# Altium project IT_Asset_Tracking_Rack_Controller-H743.PrjPcb (part 2 of 3)

## Sheet NRF52840.SchDoc: NRF52840
size A3; Author: A.Horvath; Organization: Reichle & De-Massari; Address1: Binzstrasse 32; Address2: 8620 Wetzikon; Address3: Switzerland; DocumentNumber: 3; Revision: V0.1; SheetNumber: 3; SheetTotal: 11
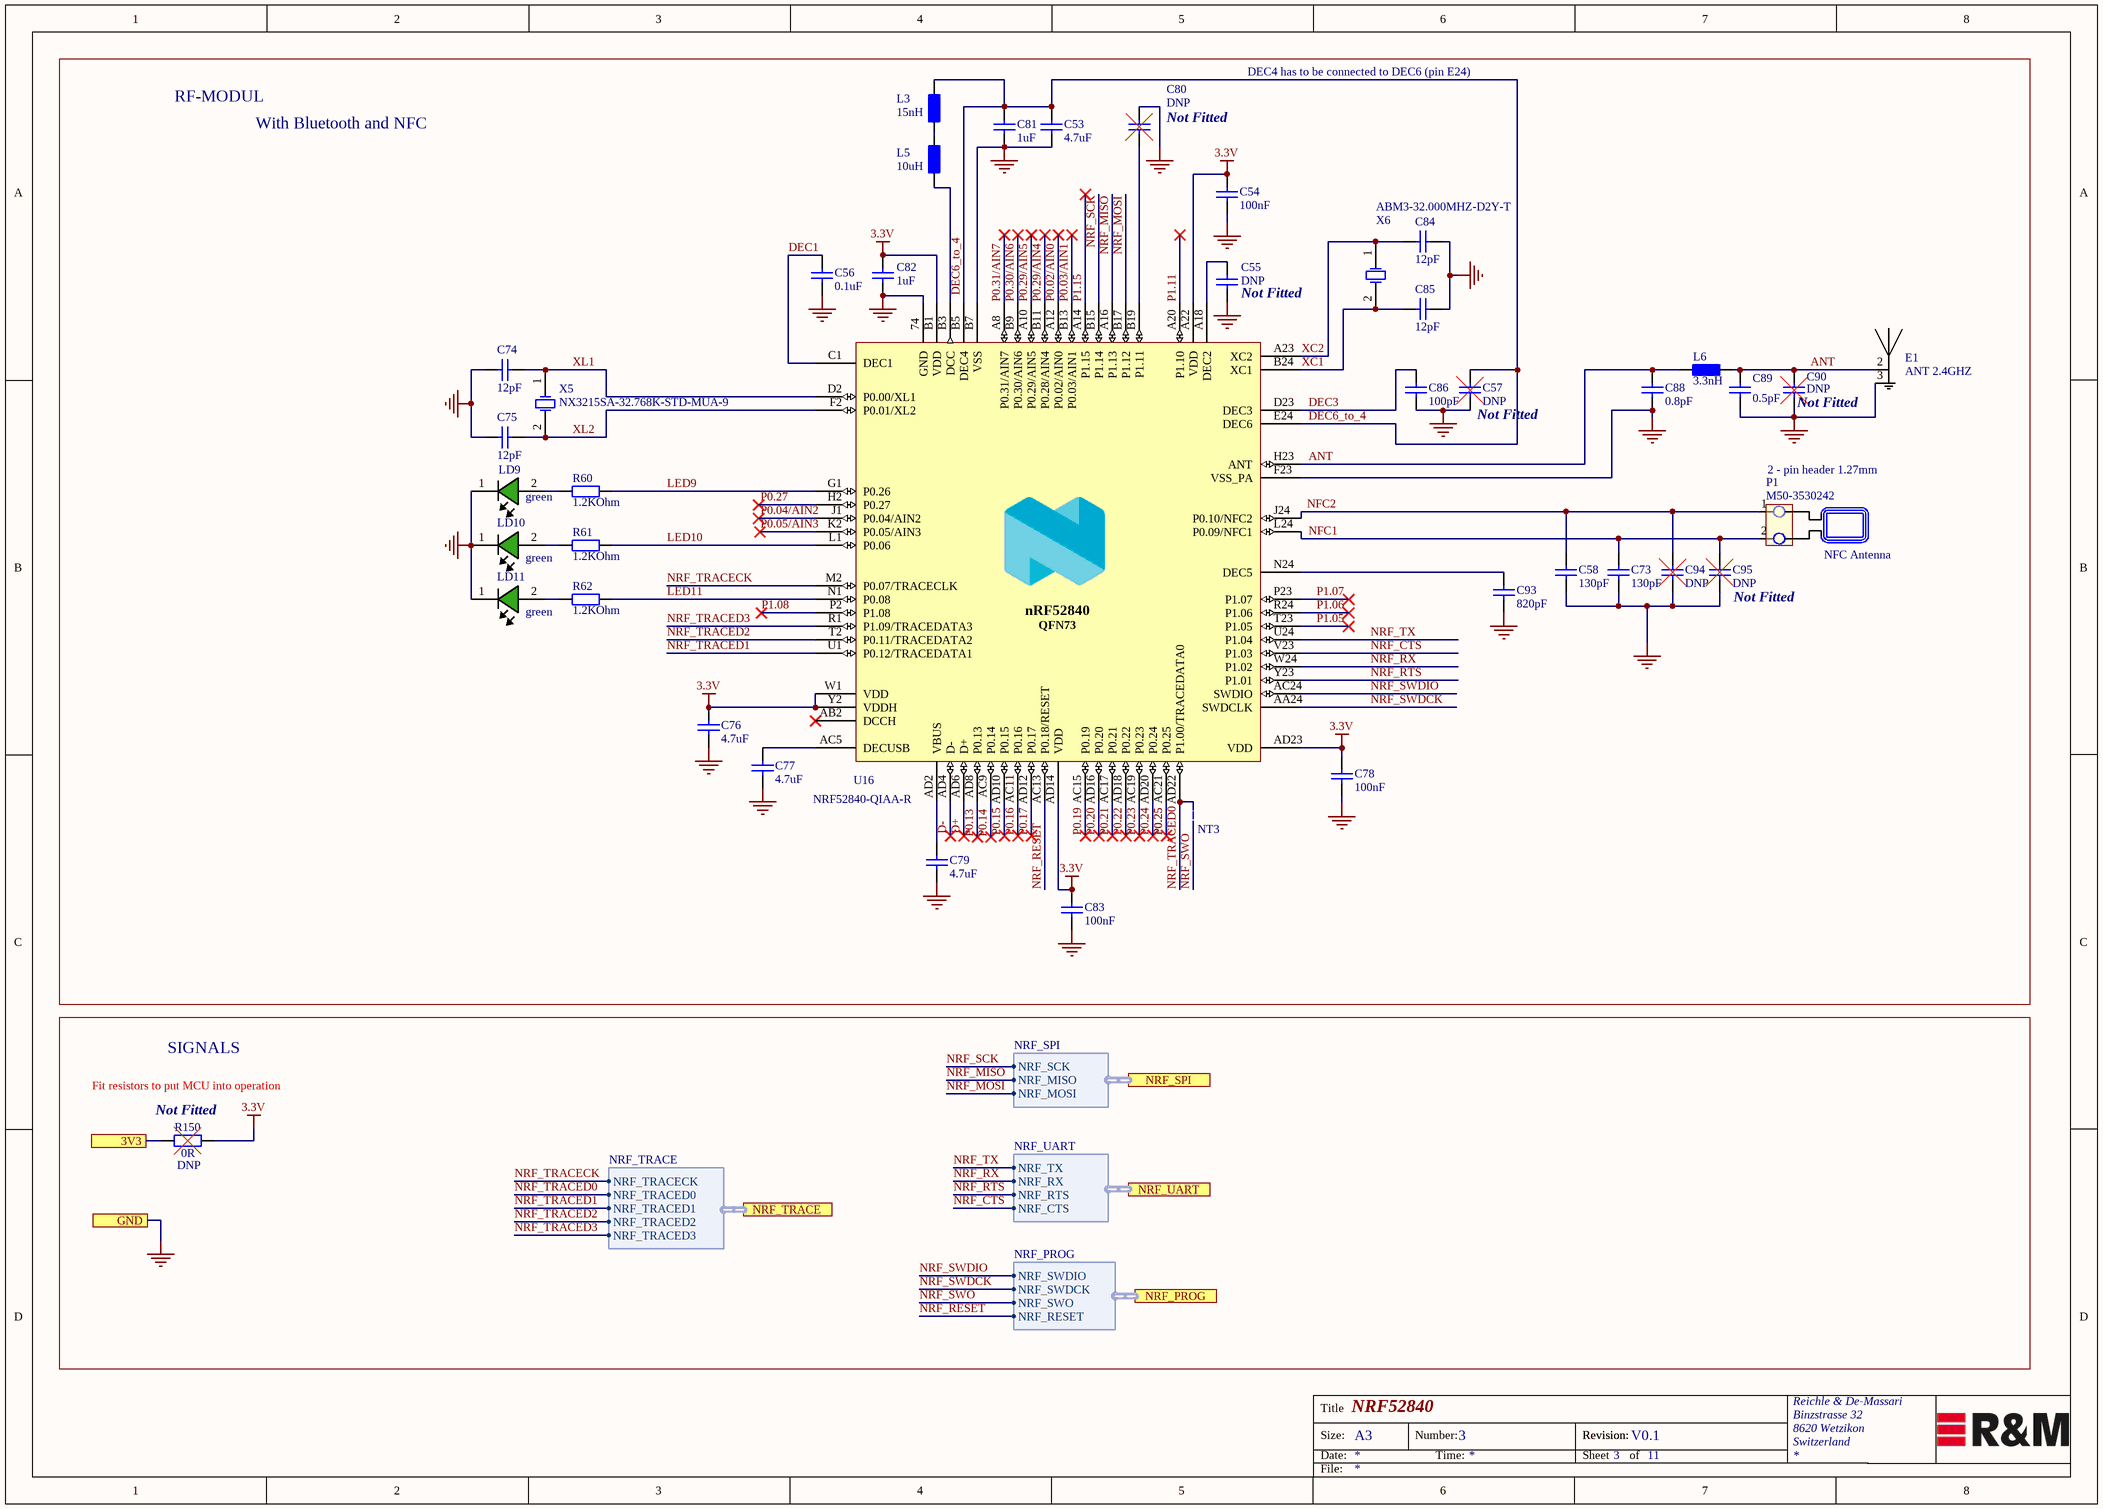
[diagram p7: NRF52840.SchDoc]

### Parts
C53  4.7uF  [Ceramic Capacitor 0402 EIA]
C54  100nF  [Ceramic Capacitor 0402 EIA]
C55  DNP  [Ceramic Capacitor 0402 EIA]
C56  0.1uF  [Ceramic Capacitor 0402 EIA]
C57  DNP  [Ceramic Capacitor 0402 EIA]
C58  130pF  [Ceramic Capacitor 0805 EIA]
C73  130pF  [Ceramic Capacitor 0805 EIA]
C74  12pF  [Ceramic Capacitor 0402 EIA]
C75  12pF  [Ceramic Capacitor 0402 EIA]
C76  4.7uF  [Ceramic Capacitor 0402 EIA]
C77  4.7uF  [Ceramic Capacitor 0402 EIA]
C78  100nF  [Ceramic Capacitor 0402 EIA]
C79  4.7uF  [Ceramic Capacitor 0402 EIA]
C80  DNP  [Ceramic Capacitor 0402 EIA]
C81  1uF  [Ceramic Capacitor 0402 EIA]
C82  1uF  [Ceramic Capacitor 0402 EIA]
C83  100nF  [Ceramic Capacitor 0402 EIA]
C84  12pF  [Ceramic Capacitor 0402 EIA]
C85  12pF  [Ceramic Capacitor 0402 EIA]
C86  100pF  [Ceramic Capacitor 0402 EIA]
C88  0.8pF  [Ceramic Capacitor 0402 EIA]
C89  0.5pF  [Ceramic Capacitor 0402 EIA]
C90  DNP  [Ceramic Capacitor 0805 EIA]
C93  820pF  [Ceramic Capacitor 0402 EIA]
C94  DNP  [Ceramic Capacitor 0805 EIA]
C95  DNP  [Ceramic Capacitor 0805 EIA]
E1  ANT 2.4GHZ  [XCVR_A5839]
L3  15nH  [INDC1005X55N]
L5  10uH  [INDC1608X100N]
L6  3.3nH  [LQG15HS3N3S02D]
LD9  green  [LED_APHHS1005CGCK]
LD10  green  [LED_APHHS1005CGCK]
LD11  green  [LED_APHHS1005CGCK]
NT3  Net-Tie_Small  [NET_TIE]  (value not drawn)  (net tie, no BOM)
P1  M50-3530242  [CONN_2x01_Harwin]  (net tie)
R60  1.2KOhm  [Resistor 0402 EIA]
R61  1.2KOhm  [Resistor 0402 EIA]
R62  1.2KOhm  [Resistor 0402 EIA]
R150  DNP  [Resistor 0805 EIA]
U16  NRF52840-QIAA-R  [AQFN50P700X700X85_HS-74N]
X5  NX3215SA-32.768K-STD-MUA-9  [NX3215SA]
X6  ABM3-32.000MHZ-D2Y-T  [XTAL500X320X130N]

### Blocks framed on the sheet
SIGNALS: R150

### Ports
3V3, GND, NRF_PROG (harness NRF_PROG), NRF_SPI (harness NRF_SPI), NRF_TRACE (harness NRF_TRACE), NRF_UART (harness NRF_UART)

### Harnesses
NRF_TRACE: NRF_TRACECK, NRF_TRACED0, NRF_TRACED1, NRF_TRACED2, NRF_TRACED3
NRF_UART: NRF_TX, NRF_RX, NRF_RTS, NRF_CTS
NRF_SPI: NRF_SCK, NRF_MISO, NRF_MOSI
NRF_PROG: NRF_SWDIO, NRF_SWDCK, NRF_SWO, NRF_RESET

### Nets
3.3V: C54.2 C76.2 C78.2 C82.2 C83.2 R150.2 U16.A22(VDD) U16.AD14(VDD) U16.AD23(VDD) U16.B1(VDD) U16.W1(VDD) U16.Y2(VDDH)
3V3: R150.1 ; port 3V3
GND: C53.1 C54.1 C55.1 C56.1 C57.1 C58.1 C73.1 C74.2 C75.2 C76.1 C77.1 C78.1 C79.1 C80.2 C81.1 C82.1 C83.1 C84.1 C85.1 C86.1 C88.2 C89.1 C90.1 C93.1 C94.1 C95.1 E1.3(GND) LD9.1 LD10.1 LD11.1 U16.74(GND) U16.B7(VSS) U16.F23(VSS_PA) ; port GND
ANT: C88.1 C89.2 C90.2 E1.2(FED) L6.1 L6.2 U16.H23(ANT)
D+: U16.AD6(D+)
D-: U16.AD4(D-)
DEC1: C56.2 U16.C1(DEC1)
DEC3: C86.2 U16.D23(DEC3)
DEC6_to_4: C53.2 C57.2 C81.2 L3.1 U16.B5(DEC4) U16.E24(DEC6)
LED9: R60.2 U16.G1(P0.26)
LED10: R61.2 U16.L1(P0.06)
LED11: R62.2 U16.N1(P0.08)
NFC1: C73.2 C95.2 P1.2 U16.L24(P0.09/NFC1)
NFC2: C58.2 C94.2 P1.1 U16.J24(P0.10/NFC2)
NRF_CTS: U16.V23(P1.03) ; port NRF_UART.NRF_CTS
NRF_MISO: U16.A16(P1.13) ; port NRF_SPI.NRF_MISO
NRF_MOSI: U16.B17(P1.12) ; port NRF_SPI.NRF_MOSI
NRF_RESET: U16.AC13(P0.18/RESET) ; port NRF_PROG.NRF_RESET
NRF_RTS: U16.Y23(P1.01) ; port NRF_UART.NRF_RTS
NRF_RX: U16.W24(P1.02) ; port NRF_UART.NRF_RX
NRF_SCK: U16.B15(P1.14) ; port NRF_SPI.NRF_SCK
NRF_SWDCK: U16.AA24(SWDCLK) ; port NRF_PROG.NRF_SWDCK
NRF_SWDIO: U16.AC24(SWDIO) ; port NRF_PROG.NRF_SWDIO
NRF_SWO: NT3.1 ; port NRF_PROG.NRF_SWO
NRF_TRACECK: U16.M2(P0.07/TRACECLK) ; port NRF_TRACE.NRF_TRACECK
NRF_TRACED0: NT3.2 U16.AD22(P1.00/TRACEDATA0) ; port NRF_TRACE.NRF_TRACED0
NRF_TRACED1: U16.U1(P0.12/TRACEDATA1) ; port NRF_TRACE.NRF_TRACED1
NRF_TRACED2: U16.T2(P0.11/TRACEDATA2) ; port NRF_TRACE.NRF_TRACED2
NRF_TRACED3: U16.R1(P1.09/TRACEDATA3) ; port NRF_TRACE.NRF_TRACED3
NRF_TX: U16.U24(P1.04) ; port NRF_UART.NRF_TX
P0.02/AIN0: U16.A12(P0.02/AIN0)
P0.03/AIN1: U16.B13(P0.03/AIN1)
P0.04/AIN2: U16.J1(P0.04/AIN2)
P0.05/AIN3: U16.K2(P0.05/AIN3)
P0.13: U16.AD8(P0.13)
P0.14: U16.AC9(P0.14)
P0.15: U16.AD10(P0.15)
P0.16: U16.AC11(P0.16)
P0.17: U16.AD12(P0.17)
P0.19: U16.AC15(P0.19)
P0.20: U16.AD16(P0.20)
P0.21: U16.AC17(P0.21)
P0.22: U16.AD18(P0.22)
P0.23: U16.AC19(P0.23)
P0.24: U16.AD20(P0.24)
P0.25: U16.AC21(P0.25)
P0.27: U16.H2(P0.27)
P0.29/AIN4: U16.B11(P0.28/AIN4)
P0.29/AIN5: U16.A10(P0.29/AIN5)
P0.30/AIN6: U16.B9(P0.30/AIN6)
P0.31/AIN7: U16.A8(P0.31/AIN7)
P1.05: U16.T23(P1.05)
P1.06: U16.R24(P1.06)
P1.07: U16.P23(P1.07)
P1.08: U16.P2(P1.08)
P1.11: U16.A20(P1.10)
P1.15: U16.A14(P1.15)
XC1: C85.2 U16.B24(XC1) X6.2(OSC2)
XC2: C84.2 U16.A23(XC2) X6.1(OSC1)
XL1: C74.1 U16.D2(P0.00/XL1) X5.1(OSC1)
XL2: C75.1 U16.F2(P0.01/XL2) X5.2(OSC2)
NetC55_2: C55.2 U16.A18(DEC2)
NetC77_2: C77.2 U16.AC5(DECUSB)
NetC79_2: C79.2 U16.AD2(VBUS)
NetC80_1: C80.1 U16.B19(P1.11)
NetC93_2: C93.2 U16.N24(DEC5)
NetL3_2: L3.2 L5.1
NetL5_2: L5.2 U16.B3(DCC)
NetLD9_2: LD9.2 R60.1
NetLD10_2: LD10.2 R61.1
NetLD11_2: LD11.2 R62.1

Not connected (* = marked no-connect by the designer): U16 AB2(DCCH)*

### Notes on the sheet
- RF-MODUL
- DEC4 has to be connected to DEC6 (pin E24)
- With Bluetooth and NFC
- (near C80) Not Fitted
- (near C55) Not Fitted
- (near C57) Not Fitted
- (near C90) Not Fitted
- (near P1) 2 - pin header 1.27mm
- (near P1) NFC Antenna
- (near C95) Not Fitted
- (near R150) Fit resistors to put MCU into operation
- (near R150) Not Fitted
- (near R150) 0R
- Title
- Size:
- Date:
- A3
- Number:
- Time:
- Revision:
- Sheet
- of
- File:
- (in symbol nRF52840_QIAA) nRF52840; QFN73

### Library data of the parts
C53 C76 C77 C79 = Cap_4.7uF_0603 _6.3V_X7R: 4.7µF ±10% 6.3V Ceramic Capacitor X7R 0603 (1608 Metric); Manufracturer: Taiyo Yuden; Manufacturer PartNr: JMK107BB7475KA-T; voltage: 6.3VDC; Replaceable: yes; tolerance: ±10%; ComponentLink1Description: mouser; ComponentLink1URL: https://www.mouser.ch/ProductDetail/Murata-Electronics/GRM155R60J475ME47D?qs=sGAEpiMZZMs0AnBnWHyRQIE6q%2f4qwWvwbJmEUwav8%2f4%3d; Dielectric Grade: X7R; Footprint/Package: 0603 (1608 metric); Supplier 1: Digi-Key; Supplier Part Number 1: 587-5870-1-ND; value: 4.7uF
C54 C78 C83 = Cap_100nF_0402_6V3: 0.1µF ±10% 6.3V Ceramic Capacitor X7R 0402 (1005 Metric); Manufacturer: Yageo; Manufacturer PartNr: CC0402KRX7R5BB104; Replaceable: yes; volatage: 6.3VDC; Dielectric Grade: X7R; Footprint/Package: 0402 (1005 metric); Supplier 1: Digi-Key; Supplier Part Number 1: 311-1701-1-ND; value: 100nF; tolerance: ±10%
C55 C57 = Cap_DNP_0402: Do not place 0402  (1005 metric) - placeholder; Replaceable: no; value: DNP; tolerance: *; voltage: *; Dielectric Grade: *; Manufacturer: N/A; Manufacturer PartNr: N/A; Footprint/Package: 0402 (1005 metric); Supplier 1: N/A; Supplier Part Number 1: N/A; Remark: do not place
C56 = Cap_0.1uF_0402_16V_10%: 0.1µF ±10% 16V Ceramic Capacitor X7R 0402 (1005 Metric); Manufacturer: Yageo; Manufacturer PartNr: CC0402KRX7R7BB104; voltage: 16VDC; Replaceable: yes; value: 0.1uF; tolerance: 10%; Footprint/Package: 0402 (1005 Metric); Dielectric Grade: X7R; ComponentLink1Description: mouser; ComponentLink1URL: https://www.mouser.ch/ProductDetail/KEMET/C0402C104M4RACAUTO?qs=sGAEpiMZZMs0AnBnWHyRQB295tntAovf0Dzw3tVX6zRfKTwHFThmZw%3d%3d; Supplier 1: Digi-Key; Supplier Part Number 1: 311-1338-1-ND
C58 C73 = Cap_130pF_0805 _50V: 130pF ±5% 50V Ceramic Capacitor C0G, NP0 0805 (2012 Metric); Manufacturer: KEMET; Manufacturer PartNr: C0805C131J5GAC7800; voltage: 50V DC; Dielectric Grade: C0G/NP0; Replaceable: yes; Supplier 1: Digi-Key; Supplier Part Number 1: 399-15446-1-ND; Footprint/Package: 0805 (2012 metric); value: 130pF; tolerance: ±5%; power: -
C74 C75 C84 C85 = Cap_12pF_0402_50V: 12pF ±2% 50V Ceramic Capacitor C0G, NP0 0402 (1005 Metric); Manufacturer: Murata; Manufacturer PartNr: GRM1555C1H120GA01D; voltage: 50VDC; Replaceable: yes; Dielectric Grade: C0G/NP0; value: 12pF; tolerance: ±2%; Footprint/Package: 0402 (1005 metric); Supplier 1: Digi-Key; Supplier Part Number 1: 490-6197-1-ND
C80 = Cap_1uF_0402_10V: 1µF ±10% 10V Ceramic Capacitor X7S 0402 (1005 Metric); Manufacturer: Murata; Manufacturer PartNr: GCM155C71A105KE38D; value: 1uF; voltage: 10VDC; Replaceable: yes; tolerance: 10%; Footprint/Package: 0402 (1005 metric); Dielectric Grade: X7S; ComponentLink1Description: mouser; ComponentLink1URL: https://www.mouser.ch/ProductDetail/Murata-Electronics/GCM155C71A105KE38D?qs=sGAEpiMZZMsh%252b1woXyUXj0FEAttKcN54ouz5zO04smg%3d; Supplier Part Number 1: 490-13409-1-ND; Supplier 1: Digi-Key
C81 C82 = Cap_1uF_0402_10V: 1µF ±10% 10V Ceramic Capacitor X7S 0402 (1005 Metric); Manufacturer: Murata; Manufacturer PartNr: GCM155C71A105KE38D; voltage: 10VDC; Replaceable: yes; value: 1uF; tolerance: 10%; Footprint/Package: 0402 (1005 metric); Dielectric Grade: X7S; ComponentLink1Description: mouser; ComponentLink1URL: https://www.mouser.ch/ProductDetail/Murata-Electronics/GCM155C71A105KE38D?qs=sGAEpiMZZMsh%252b1woXyUXj0FEAttKcN54ouz5zO04smg%3d; Supplier Part Number 1: 490-13409-1-ND; Supplier 1: Digi-Key
C86 = Cap_100pF_0402_10V: 100pF ±5% 10V Keramikkondensatoren C0G, NP0 0402 (1005 metrisch); Manufacturer: Yageo; Manufacturer PartNr: 885012005013; voltage: 10VDC; Replaceable: yes; Dielectric Grade: C0G/NP0; value: 100pF; tolerance: ±5%; Footprint/Package: 0402 (1005 metric); Supplier 1: Digi-Key; Supplier Part Number 1: 732-7431-1-ND
C88 = Cap_0.8pF_0402_50V: 0.8pF ±0.1pF 50V Ceramic Capacitor C0G, NP0 0402 (1005 Metric); Manufacturer: Murata; Manufacturer PartNr: GJM1555C1HR80BB01D; Dielectric Grade: C0G/NP0; Voltage: 50 VDC; Replaceable: yes; Supplier 1: Digi-Key; Supplier Part Number 1: 490-6080-1-ND; Footprint/Package: 0402 (1005 metric); value: 0.8pF; ComponentLink1URL: http://search.murata.co.jp/Ceramy/image/img/A01X/G101/ENG/GJM1555C1HR80BB01-01.pdf; ComponentLink1Description: http://search.murata.co.jp/Ceramy/image/img/A01X/G101/ENG/GJM1555C1HR80BB01-01.pdf; ComponentLink2URL: http://search.murata.co.jp/Ceramy/image/img/w_hinm/L0005E.pdf; ComponentLink2Description: http://search.murata.co.jp/Ceramy/image/img/w_hinm/L0005E.pdf; ComponentLink3URL: http://psearch.murata.com/capacitor/product/GJM1555C1HR80BB01%23.pdf; ComponentLink3Description: http://psearch.murata.com/capacitor/product/GJM1555C1HR80BB01%23.pdf; ComponentLink4URL: https://www.verical.com/server-webapp/html/getDatasheet?partID=75095; ComponentLink4Description: https://www.verical.com/server-webapp/html/getDatasheet?partID=75095; tolerance: ±0.1pF; power: -
C89 = Cap_0.5pF_0402_50V: 0.5pF ±0.05pF 50V Ceramic Capacitor C0G, NP0 0402 (1005 Metric), Murata; Manufacturer PartNr: GJM1555C1HR50WB01D; Dielectric Grade: C0G/NP0; Voltage: 50 VDC; Replaceable: yes; Supplier 1: Digi-Key; Supplier Part Number 1: 490-11250-1-ND; Manufacturer: Murata; Footprint/Package: 0402 (1005 metric); value: 0.5pF; tolerance: ±0.05pF; power: -; ComponentLink1Description: Datasheet; ComponentLink1URL: https://search.murata.co.jp/Ceramy/image/img/A01X/G101/ENG/GJM1555C1HR50WB01-01.pdf
C90 C94 C95 = Cap_DNP_0805: Do not place 0805 (2012 metric) - placeholder; Replaceable: no; value: DNP; tolerance: *; voltage: *; Dielectric Grade: *; Manufacturer: N/A; Manufacturer PartNr: N/A; Footprint/Package: 0805 (2012 metric); Supplier 1: N/A; Supplier Part Number 1: N/A; Remark: do not place
C93 = Cap_820pF_0402_50V: 820pF ±5% 50V Ceramic Capacitor C0G, NP0 0402 (1005 Metric); Manufacturer: Muarata Electronics; Manufacturer PartNr: GRM1555C1H821JA01J; voltage: 50 VDC; Replaceable: no; Dielectric Grade: C0G/NP0; value: 820pF; tolerance: ±5%; Footprint/Package: 0402 (1005 metric); ComponentLink1Description: digikey; ComponentLink1URL: https://www.digikey.com/product-detail/en/murata-electronics-north-america/GJM1555C1H150FB01D/490-11191-6-ND/5333833; Supplier 1: Digi-Key; Supplier Part Number 1: 490-11407-1-ND
E1 = Antenna_2.4GHZ_PCB: 2,4GHz Bluetooth, Wi-Fi, Zigbee PCB HF-Antenna,1dBi SMD, Antenova; Manufacturer Part Number: A5839; Replaceable: no; Package: None; Manufacturer: Antenova; value: ANT 2.4GHZ; Supplier 1: Digi-Key; Supplier Part Number 1: 627-1011-1-ND; Footprint/Package: specific see datasheet; tolerance: -; power: -; Dielectric Grade: -; voltage: -
L3 = Ind_15nH_0402: 15nH Unshielded Multilayer Inductor 320mA 460mOhm Max 0402 (1005 Metric),  Taiyo Yuden; Manufacturer PartNr: HK100515NJ-T; Replaceable: no; value: 15uH; tolerance: ±5%; Manufacturer: TAIYO YUDEN; voltage: *; power: -; Supplier Part Number 1: 587-1521-1-ND; Supplier 1: Digi-Key; Dielectric Grade: -; Footprint/Package: 0402 (1005 metric)
L5 = Ind_10uH_0603: 10µH Unshielded Wirewound Inductor 80mA 360mOhm 0603 (1608 Metric); Manufacturer: TAIYO YUDEN; Manufacturer PartNr: LBMF1608T100K; tolerance: ±10%; Replaceable: no; value: 10uH; Supplier 1: Digi-Key; Supplier Part Number 1: 587-1714-6-ND; voltage: *; power: *; Footprint/Package: 0603 (1608 metric)
L6 = Ind_3.3nH_0402: 3.3nH Unshielded Multilayer Inductor 800mA 170mOhm Max 0402 (1005 Metric); Manufacturer: Murata Electronics; Replaceable: no; Manufacturer PartNr: LQG15HS3N3S02D; Dielectric Grade: -; voltage: -; Supplier 1: DIgi-Key; Supplier Part Number 1: 490-2616-1-ND; Footprint/Package: 0402 (1005 metric); tolerance: -; value: 3.3nH
LD9-LD11 = LED_GREEN_0402: Green 570nm LED Indication - Discrete 2.1V 0402 (1005 Metric); Manufacturer: Kingbright; Manufacturer PartNr: APHHS1005CGCK; Replaceable: yes; voltage: 2.1V (forward); Footprint/Package: 0420 (1005 metric); value: green; Supplier 1: Digi-Key; Supplier Part Number 1: 754-1101-1-ND; Dielectric Grade: -; tolerance: -; power: -
NT3 = Net-Tie_Small: Net-Tie allowing to short two different types of nets.
P1 = CONN_1x2_M50-3530242: 2 Pin, 1 Row, Jumper, 1.27mm; Manufacturer: Harwin; Replaceable: yes; Footprint/Package: 1.27mm; ComponentLink1Description: digikey; ComponentLink1URL: https://www.digikey.com/product-detail/en/harwin-inc/M50-3530242/952-3598-ND/7044013; Supplier1: digikey; Supplier Part Number 1: 952-3598-ND; Dielectric Grade: -; power: -; voltage: -; value: M50-3530242; tolerance: -; Manufacturer PartNr: M50-3530242
R60-R62 = Res_1K2_0402: 1.2 kOhms ±0.5% 0.063W, 1/16W Chip Resistor 0402 (1005 Metric) Thin Film; Manufacturer: Panasonic; Manufacturer PartNr: ERA-2AED122X; value: 1.2K; voltage: 50V; Replaceable: yes; Supplier 1: Digi-Key; Supplier Part Number 1: P1.2KDECT-ND; Footprint/Package: 0402 (1005 metric); tolerance: ±0.5%; power: 0.063W, 1/16W; Dielectric Grade: -
R150 = Res_DNP_0805: Resistor: do not populate; Replaceable: no; value: DNP; tolerance: *; power: *; Manufacturer: do not populate; Footprint/Package: 0805; Manufacturer PartNr: do not populate
U16 = nRF52840_QIAA: Multi-protocol Bluetooth Low Energy, IEEE 802.15.4, ANT and 2.4GHz proprietary system-on-chip; Manufacturer: Nordic Semiconductor; Replaceable: no; voltage: 1.7V ~ 5.5V; Manufacturer PartNr: NRF52840-QIAA-R; power: -; Dielectric Grade: -; value: NRF52840-QIAA-R; Supplier 1: Digi-Key; Footprint/Package: 73-AQFN (7x7mm); Supplier  Part Number 1: 1490-1071-1-ND; tolerance: -
X5 = CRYSTAL_2Pin_ NX3215SA-32.768K-STD-MUA-9: 32.768kHz ±20ppm Crystal 9pF 70 kOhms 2-SMD, No Lead; Manufacturer: NDK America; Replaceable: no; Footprint/Package: 2-SMD, specific see datasheet; voltage: -; Manufacturer PartNr: NX3215SA-32.768K-STD-MUA-9; value: NX3215SA-32.768K-STD-MUA-9; Supplier 1: Digi-Key; Supplier Part Number 1: 644-1155-1-ND; tolerance: ±20ppm; Dielectric Grade: -; power: -
X6 = CRYSTAL_2Pin_32.000MHZ-D2Y-T: Crystal  32MHz ±20ppm Crystal 18pF 25 Ohms 2-SMD, No Lead; Manufacturer: Abracon; Replaceable: no; Footprint/Package: 2-SMD, specific see datasheet; voltage: -; Manufacturer PartNr: ABM3-32.000MHZ-D2Y-T; Price: None; value: ABM3-32.000MHZ-D2Y-T; Supplier 1: Digi-Key; Supplier Part Number 1: 535-10648-6-ND; tolerance: ±20ppm; Dielectric Grade: -

## Sheet RS-485.SchDoc: RS-485
size A3; Author: A.Horvath; Organization: Reichle & De-Massari; Address1: Binzstrasse 32; Address2: 8620 Wetzikon; Address3: Switzerland; DocumentNumber: 5; Revision: 0.1V; SheetNumber: 5; SheetTotal: 11
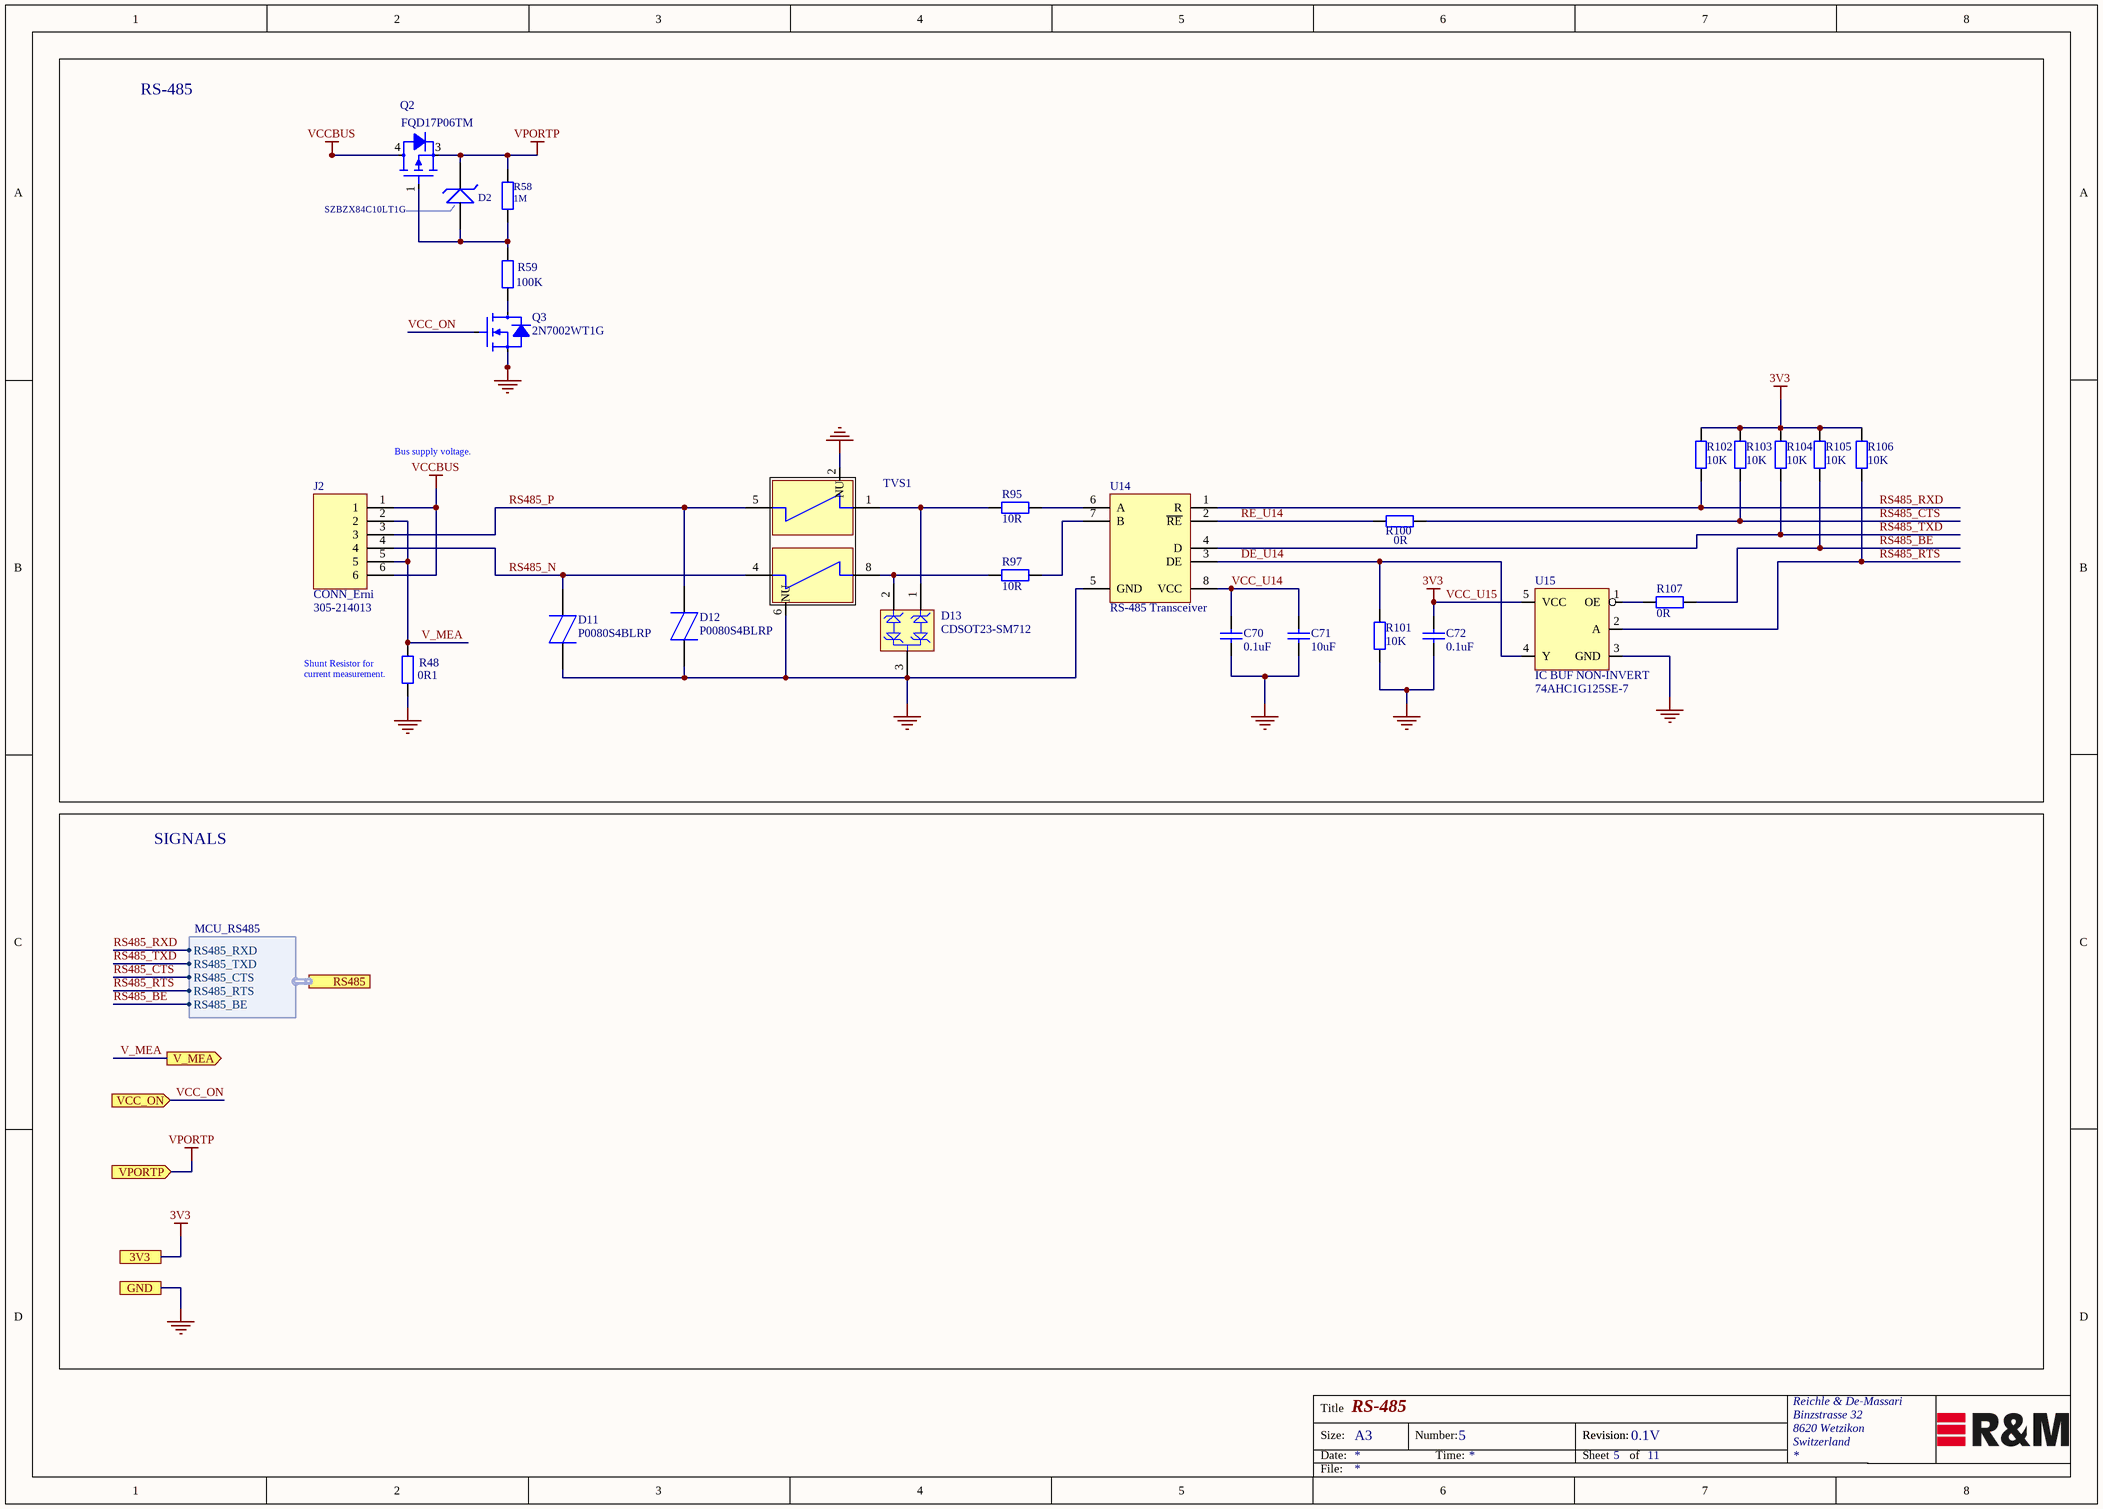
[diagram p8: RS-485.SchDoc]

### Parts
C70  0.1uF  [Ceramic Capacitor 0402 EIA]
C71  10uF  [Ceramic Capacitor 0402 EIA]
C72  0.1uF  [Ceramic Capacitor 0402 EIA]
D2  SZBZX84C10LT1G  [SOT-23_BZX84]
D11  P0080S4BLRP  [P0080S4BLRP]
D12  P0080S4BLRP  [P0080S4BLRP]
D13  CDSOT23-SM712  [BOUR-SOT23-3_V]
J2  CONN_Erni  Supplier Part Number 1: 305-214013  [ERNI_214013 Randmontage_6_R]
Q2  FQD17P06TM  [DPAK_FQU17P06]
Q3  2N7002WT1G  [SOT323_2N7002WT1G]
R48  0R1  [Resistor 4527]
R58  1M  [Resistor 0402 EIA]
R59  100K  [Resistor 0402 EIA]
R95  10R  [Resistor 0603 EIA]
R97  10R  [Resistor 0603 EIA]
R100  0R  [Resistor 0402 EIA]
R101  10K  [Resistor 0402 EIA]
R102  10K  [Resistor 0402 EIA]
R103  10K  [Resistor 0402 EIA]
R104  10K  [Resistor 0402 EIA]
R105  10K  [Resistor 0402 EIA]
R106  10K  [Resistor 0402 EIA]
R107  0R  [Resistor 0402 EIA]
TVS1  TBU-CA065-200-WH  [Bourns_TBU_PL060_WH]  (value not drawn)
U14  RS-485 Transceiver  [TI_D (R-PDSO-G8)_8_R]
U15  IC BUF NON-INVERT  [SOT353]

### Blocks framed on the sheet
RS-485: C70-C72 D2 D11-D13 J2 Q2 Q3 R48 R58 R59 R95 R97 R100-R107 TVS1 U14 U15

### Ports
3V3, GND, RS485 (harness MCU_RS485), V_MEA (out), VCC_ON (in), VPORTP (in)

### Harnesses
MCU_RS485: RS485_RXD, RS485_CTS, RS485_TXD, RS485_BE, RS485_RTS

### Nets
3V3: C72.2 R102.1 R103.1 R104.1 R105.1 R106.1 U15.5(VCC) ; port 3V3  [also labelled VCC_U15]
GND: C70.1 C71.1 C72.1 D11.1(A) D12.1(A) D13.3 Q3.2 R48.2 R101.2 TVS1.2(NU) TVS1.6(NU) U14.5(GND) U15.3(GND) ; port GND
VCCBUS: J2.1 J2.6 Q2.4
VPORTP: D2.3(K) Q2.3 R58.1 ; port VPORTP
DE_U14: R101.1 U14.3(DE) U15.4(Y)
RE_U14: R100.1 U14.2(~{RE})
RS485_BE: R105.2 R107.2 ; port RS485.RS485_BE
RS485_CTS: R100.2 R103.2 ; port RS485.RS485_CTS
RS485_N: D11.2(K) J2.4 TVS1.4
RS485_P: D12.2(K) J2.3 TVS1.5
RS485_RTS: R106.2 U15.2(A) ; port RS485.RS485_RTS
RS485_RXD: R102.2 U14.1(R) ; port RS485.RS485_RXD
RS485_TXD: R104.2 U14.4(D) ; port RS485.RS485_TXD
V_MEA: J2.2 J2.5 R48.1 ; port V_MEA
VCC_ON: Q3.1 ; port VCC_ON
VCC_U14: C70.2 C71.2 U14.8(VCC)
NetD2_1: D2.1(A) Q2.1 R58.2 R59.1
NetD13_1: D13.1 R95.1 TVS1.1
NetD13_2: D13.2 R97.1 TVS1.8
NetQ3_3: Q3.3 R59.2
NetR95_2: R95.2 U14.6(A)
NetR97_2: R97.2 U14.7(B)
NetR107_1: R107.1 U15.1(OE)

### Notes on the sheet
- Bus supply voltage.
- (near R48) Shunt Resistor for current measurement.
- SIGNALS
- Title
- Size:
- Date:
- A3
- Number:
- Time:
- Revision:
- Sheet
- of
- File:

### Library data of the parts
C70 C72 = Cap_0.1uF_0402_10V: as C98 on sheet MCU_STM32H743BI; value: 0.1uF; tolerance: 20%; Footprint/Package: 0402; Dielectric Grade: X5R; ComponentLink1Description: mouser; ComponentLink1URL: https://www.mouser.ch/ProductDetail/Wurth-Electronics/885012105010?qs=sGAEpiMZZMs0AnBnWHyRQEGbLOF2VP1ihL84oCjXnlO407YOHi%2fQbw%3d%3d; Supplier 1: Digi-Key; Supplier 2: Farnell; Supplier 3: Mouser; Supplier Part Number 3: 710-885012105010; Supplier Part Number 2: 2533928; Supplier Part Number 1: 732-7487-1-ND
C71 = Cap_10uF_0402_10V: 10µF ±20% 10V Ceramic Capacitor X5R 0402 (1005 Metric); Manufacturer: Samsung Electro-Mechanics; Manufacturer PartNr: CL05A106MP8NUB8; voltage: 10VDC; Replaceable: yes; value: 10uF; tolerance: 20%; ComponentLink1Description: mouser; ComponentLink1URL: https://www.mouser.ch/ProductDetail/Murata-Electronics/ZRB15XR61A106ME01D?qs=sGAEpiMZZMs0AnBnWHyRQN7%2fAA2D2lPPC0%2fdyv23S%2fU%252bBeuYI5b1UA%3d%3d; Footprint/Package: 0402 (1005 metric); Dielectric Grade: X5R; Supplier 1: Digi-Key; Supplier Part Number 1: 1276-6830-1-ND
D2 = Diode_SZBZX84C10LT1G: Zener Diode 10V 225mW ±6% Oberflächenmontage SOT-23-3 (TO-236); Manufacturer: ON Semiconductor; Replaceable: no; Manufacturer PartNr: SZBZX84C10LT1G; Footprint/Package: SOT-23-3 (TO-236); Supplier 1: Digi-Key; Supplier Part Number 1: SZBZX84C10LT1GOSDKR-ND; power: 225mW; value: SZBZX84C10LT1G; voltage: 10V
D11 D12 = P0080S4BLRP: Thyristor Surge Protection Devices (TSPD) PxxxxS4xLRP Series SIDACtor Protection Thyristor 100A 25V Bi SOD; Manufacturer: Littelfuse; Replaceable: no; ComponentLink1Description: mouser; ComponentLink1URL: https://www.mouser.ch/ProductDetail/Diodes-Incorporated/DESD3V3S1BL-7B?qs=%2fha2pyFaduhA707awRoRgtNXj1BWecNQPXz8CtVYm9O48rqwfwJI0g%3d%3d; Footprint/Package: SOD-123FL; Supplier 1: Mouser; Supplier Part Number 1: 576-P0080S4BLRP; Supplier 2: Digikey; Supplier Part Number 2: P0080S4BLRPCT-ND; Manufacturer PartNr: P0080S4BLRP
D13 = Diode_TVS_26V: TVSDiode, 26V, 14V Clamp 17A (8/20µs) Ipp, Surface Mount SOT-23-3, Applications RS-485; Manufacturer: Bourns; power: 400W; Replaceable: no; Dielectric Grade: NA; Supplier 1: Digi-Key; Package / Case: TO-236-3,SC-59,SOT-23-3; Supplier Part Number 1: CDSOT23-SM712CT-ND; voltage: 26V, 14V; value: CDSOT23-SM712; Footprint/Package: DO-214AC-2 (SMA); Manufacturer PartNr: CDSOT23-SM712
J2 = CONN_Erni_6_214013: Headers & Wire Housings 6P 1.27MM SNGL ROW R/A MALE BLK; Manufacturer: ERNI; Manufacturer PartNr: 214013; Replaceable: no; Footprint/Package: 1.27mm; ComponentLink1Description: mouser; ComponentLink1URL: https://www.mouser.ch/ProductDetail/ERNI/214013?qs=sGAEpiMZZMvMXbh32ZmHAMhEPQG9jaj7Ou3J%2fuOb4IQ%3d; Supplier 1: Mouser
Q2 = FQD17P06TM: P-Channel 60V 12A (Tc) 2.5W (Ta), 44W (Tc) Surface Mount D-Pak; Manufacturer: ON Semiconductor; tolerance: NA; Replaceable: no; value: FQD17P06TM; voltage: 60V; Manufacturer PartNr: FQD17P06TM; Footprint/Package: TO-252-3, DPak; Dielectric Grade: NA; ComponentLink1Description: mouser; ComponentLink1URL: https://www.mouser.ch/ProductDetail/Murata-Electronics/GCM155C71A105KE38D?qs=sGAEpiMZZMsh%252b1woXyUXj0FEAttKcN54ouz5zO04smg%3d; Supplier Part Number 1: FQD17P06TMCT-ND; Supplier 1: Digi-Key; power: 2.5W
Q3 = 2N7002WT1G: N-Channel 60V 310mA (Ta) 280mW (Tj) Surface Mount SC-70-3 (SOT323); Manufacturer: ON Semiconductor; tolerance: NA; Replaceable: no; value: 2N7002WT1G; voltage: 60V; Manufacturer PartNr: 2N7002WT1G; Footprint/Package: SC-70, SOT-323; Dielectric Grade: NA; ComponentLink1Description: mouser; ComponentLink1URL: https://www.mouser.ch/ProductDetail/Murata-Electronics/GCM155C71A105KE38D?qs=sGAEpiMZZMsh%252b1woXyUXj0FEAttKcN54ouz5zO04smg%3d; Supplier Part Number 1: 2N7002WT1GOSCT-ND; Supplier 1: Digi-Key; power: 280mW
R48 = Res_0R1: 100 mOhms ±1% 5W Chip Resistor 4527 J-Lead Anti-Sulfur, Automotive AEC-Q200, Current Sense, Moisture Resistant; Manufacturer: Vishay / Dale; Manufacturer PartNr: WSR5R1000FEA; Replaceable: no; value: 0R1; tolerance: ±1%; power: 5W; Footprint/Package: 4527 (11570 metric); Supplier 1: Digi-Key; Supplier Part Number 1: WSRC-.1CT-ND
R58 = Res_1M_0402: 1 MOhms ±1% 0.1W, 1/10W Chip Resistor 0402 (1005 Metric) Anti-Sulfur Thin Film; Manufacturer: Vishay Beyschlag; Manufacturer PartNr: MCS04020C1004FE000; Replaceable: yes; Supplier 1: Digi-Key; Supplier Part Number 1: MCS0402-1.00M-CFCT-ND; Footprint/Package: 0402 (1005 metric); value: 1M; power: 0.1W, 1/10W; tolerance: ±1%; Dielectric Grade: -
R59 = Res_100K_0402: 100 kOhms ±0,1% 0,063W, 1/16W Chip-Widerstand 0402 (1005 metrisch) Dünnschicht; Manufacturer: Yageo; Manufacturer PartNr: RT0402BRD07100KL; tolerance: ±0.1%; Replaceable: yes; value: 100K; power: 0,063W, 1/16W; Footprint/Package: 0402 (1005 metrisch); Supplier 1: Digi-Key; Supplier Part Number 1: YAG1343CT-ND
R95 R97 = Res_10R_0603: SMD 1/4watt 10ohms 1%; Manufacturer: Vishay; Manufacturer PartNr: CRCW060310R0FKEAHP; power: 250mW; Replaceable: yes; value: 10R; tolerance: 1%; Footprint/Package: 0603 (1608 metric); Supplier 1: Digi-Key; Supplier 2: Mouser; Supplier Part Number 2: CRCW060310R0FKEAHP; Supplier Part Number 1: 541-10.0SCT-ND
R100 R107 = Res_0R_0402: 0 Ohms Resistor 0402; Manufacturer: Panasonic Electronic Components; Manufacturer PartNr: ERJ-2GE0R00X; power: 100mW; Replaceable: yes; value: 0R; tolerance: -; Footprint/Package: 0402 (1005 metric); Supplier 1: Digi-Key; Supplier Part Number 1: P0.0JCT-ND
R101-R106 = Res_10K_0402: SMD 10K ohm 1% 50V General Purpose; Manufacturer: Yageo; Manufacturer PartNr: RC0402FR-1010KL; power: 63mW; Replaceable: yes; value: 10K; tolerance: 1%; ComponentLink1Description: mouser; ComponentLink1URL: https://www.mouser.ch/ProductDetail/Yageo/RC0402FR-1010KL?qs=sGAEpiMZZMtlubZbdhIBIEgN9MQql2m6Sb2LnYlCICU%3d; Footprint/Package: 0402; Supplier 1: Mouser; Supplier Part Number 1: 603-RC0402FR-1010KL; Supplier 2: Digi-Key; Supplier Part Number 2: *
TVS1 = Bourns_TBU-PL060-200-WH: TBU-PL Series dual 50 ohm Surge Suppressors, bi-directional; Manufacturer: Bourns; Replaceable: no; voltage: 350V; power: NA; Manufacturer PartNr: TBU-PL060-200-WH; Supplier 1: Mouser; Footprint/Package: DFN; Supplier Part Number 1: 652-TBU-PL060-200-WH; value: TBU-PL060-200-WH; Dielectric Grade: NA
U14 = SN65HVD11DR: RS-485 Interface IC 3.3V Differential Transceivers; Manufacturer: Texas Instruments; Replaceable: no; Manufacturer PartNr: SN65HVD11DR; ComponentLink1Description: mouser; ComponentLink1URL: https://www.mouser.ch/ProductDetail/Texas-Instruments/SN65HVD11DR?qs=sGAEpiMZZMtk5jbcouIbS2cUqarwnJ3LOIItPoxnG4E%3d; Footprint/Package: SOIC-8; Supplier 1: Digi-Key; Supplier 2: Farnell; Supplier 3: Mouser; Supplier Part Number 1: 296-31717-6-ND; Supplier Part Number 2: 2436743; Supplier Part Number 3: 595-SN65HVD11DR
U15 = 74AHC1G125SE-7: Buffer, Non-Inverting 1 Element 1 Bit per Element 3-State Output SOT-353; Manufacturer: Diodes Incorporated; Replaceable: no; Footprint/Package: SOT353; ComponentLink1Description: mouser; ComponentLink1URL: https://www.mouser.ch/ProductDetail/Samtec/BBL-103-G-E?qs=sGAEpiMZZMs%252bGHln7q6pm5ZHNJhTjtr3eyJKd0ZImQM%3d; Supplier 2: Mouser; Supplier 1: Digi-Key; Supplier 3: Farnell; Supplier Part Number 1: SAM1104-03-ND; Supplier Part Number 2: 200-SL103G12; Supplier Part Number 3: 2019491; Manufacturer PartNr: 74AHC1G125SE-7

## Sheet Connectors.SchDoc: Connectors
size A3; Author: A.Horvath; Organization: Reichle & De-Massari; Address1: Binzstrasse 32; Address2: 8620 Wetzikon; Address3: Switzerland; DocumentNumber: 9; Revision: V0.1; SheetNumber: 9; SheetTotal: 11
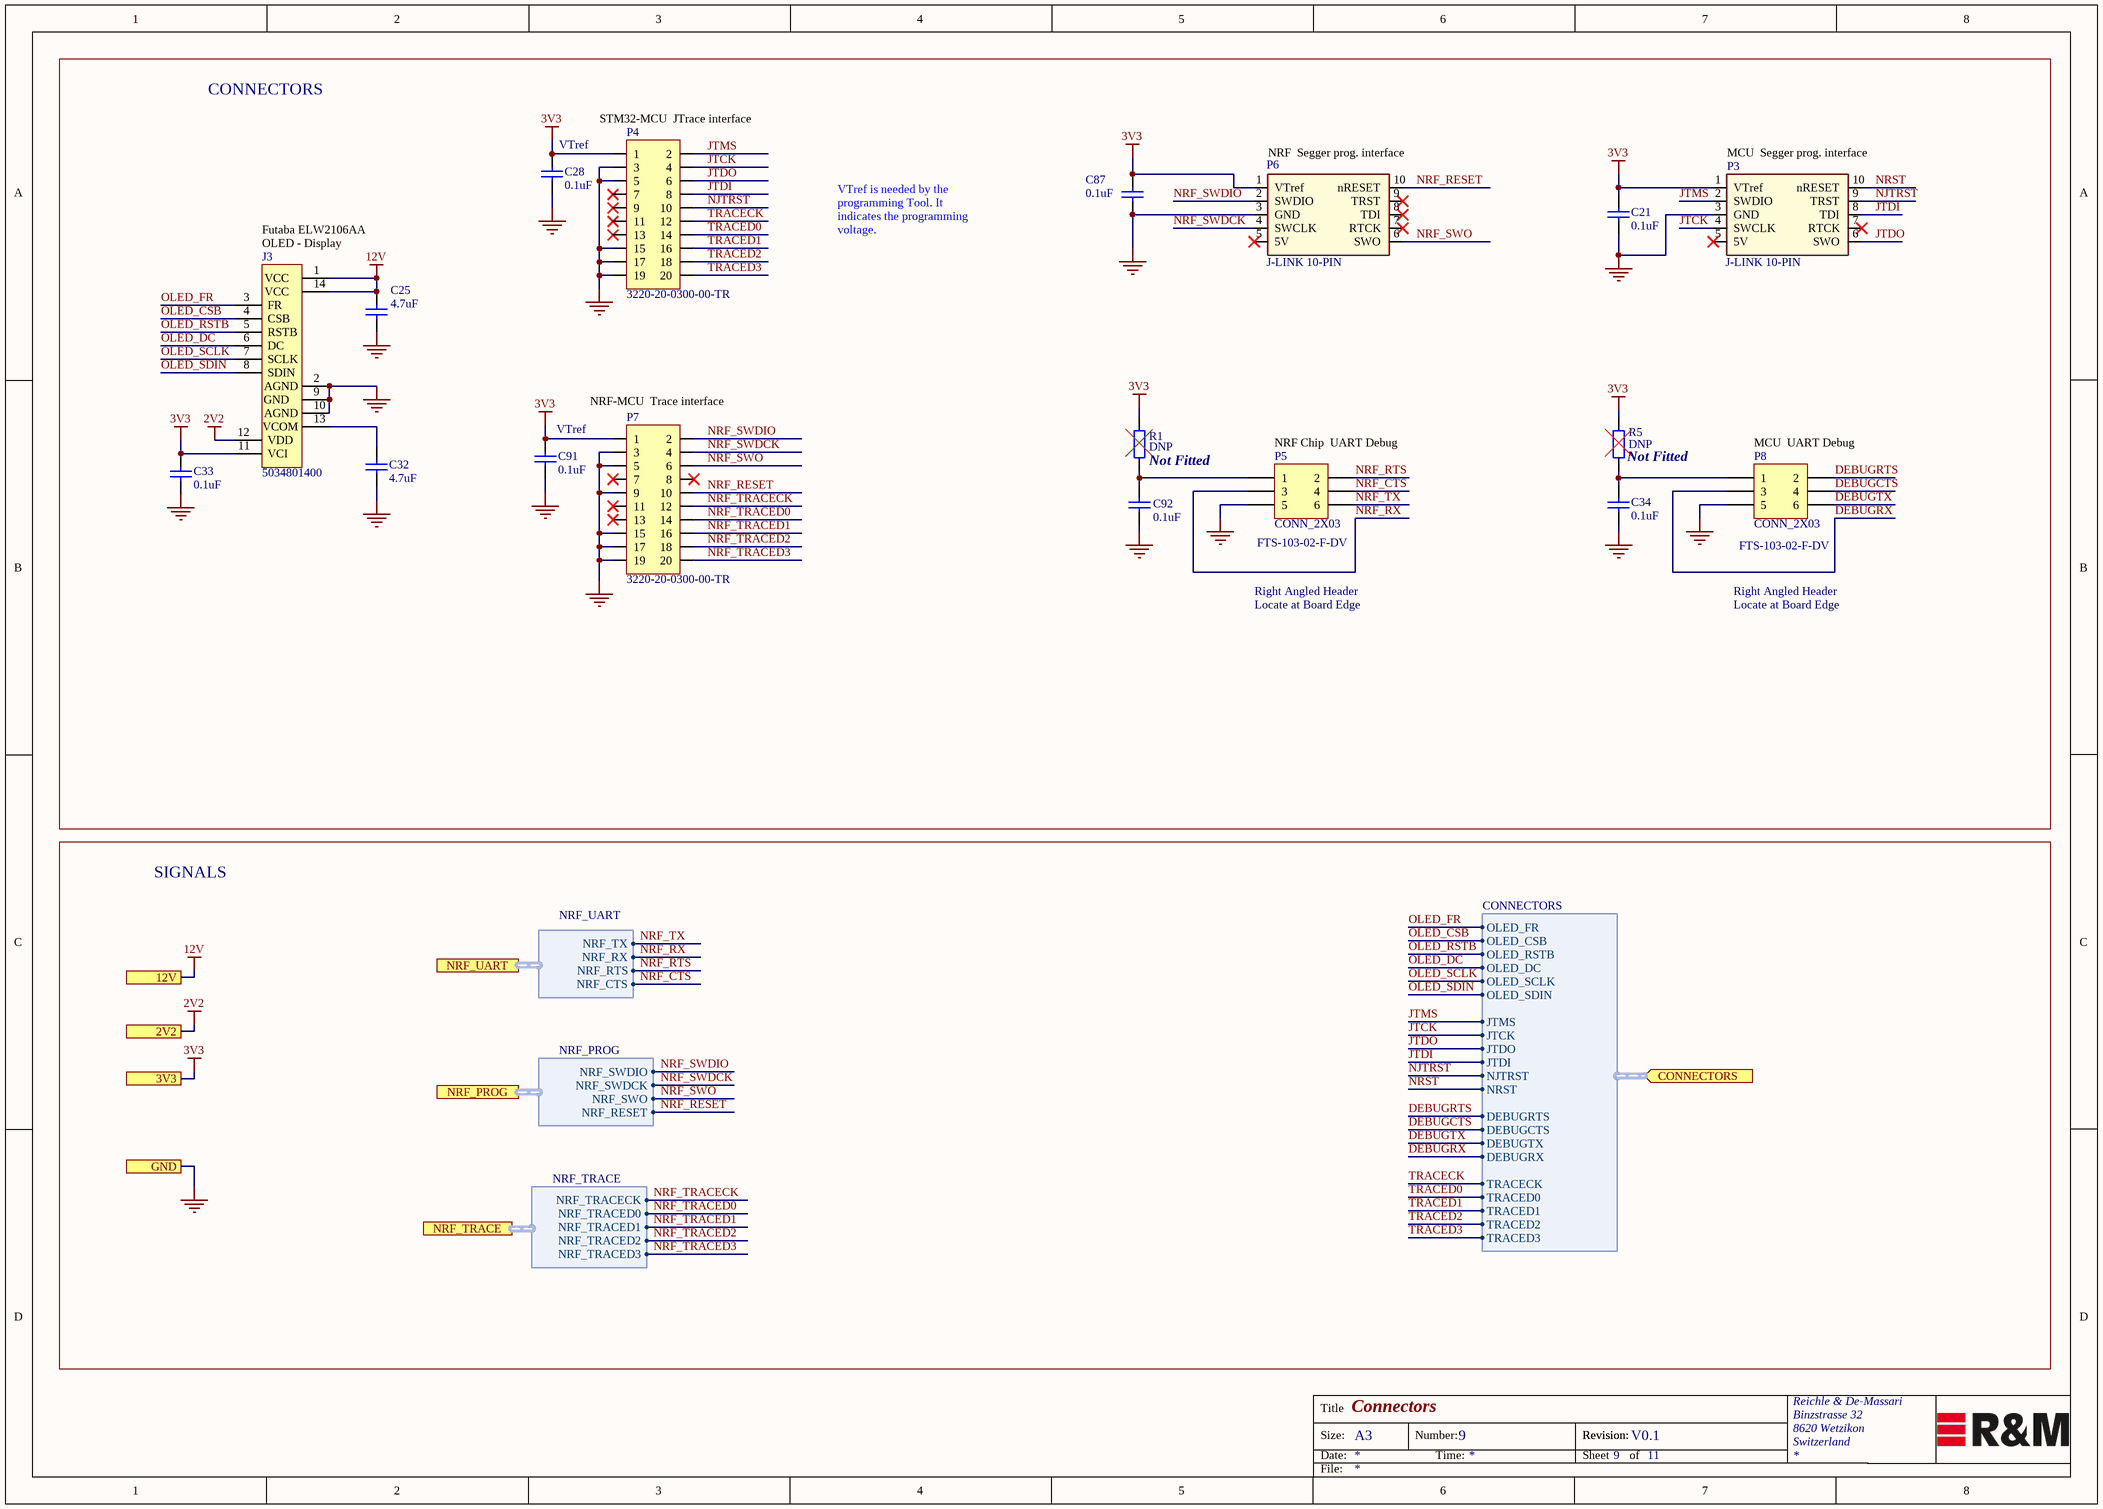
[diagram p9: Connectors.SchDoc]

### Parts
C21  0.1uF  [Ceramic Capacitor 0402 EIA]
C25  4.7uF  [Ceramic Capacitor 0603 EIA]
C28  0.1uF  [Ceramic Capacitor 0402 EIA]
C32  4.7uF  [Ceramic Capacitor 0603 EIA]
C33  0.1uF  [Ceramic Capacitor 0402 EIA]
C34  0.1uF  [Ceramic Capacitor 0402 EIA]
C87  0.1uF  [Ceramic Capacitor 0402 EIA]
C91  0.1uF  [Ceramic Capacitor 0402 EIA]
C92  0.1uF  [Ceramic Capacitor 0402 EIA]
J3  5034801400  [Molex_5034801400]
P3  J-LINK 10-PIN  [CONN-SEGGER-10-PIN]
P4  3220-20-0300-00-TR  [CNC_Tech_Conn_Header_2x10]
P5  CONN_2X03  Manufacturer PartNr: FTS-103-02-F-DV  [Samtec_FTS-103-02-F-DV_6_R]
P6  J-LINK 10-PIN  [CONN-SEGGER-10-PIN]
P7  3220-20-0300-00-TR  [CNC_Tech_Conn_Header_2x10]
P8  CONN_2X03  Manufacturer PartNr: FTS-103-02-F-DV  [Samtec_FTS-103-02-F-DV_6_R]
R1  DNP  [Resistor 0603 EIA]
R5  DNP  [Resistor 0603 EIA]

### Ports
2V2, 3V3, 12V, CONNECTORS (in, harness CONNECTORS), GND, NRF_PROG (harness NRF_PROG), NRF_TRACE (harness NRF_TRACE), NRF_UART (harness NRF_UART)

### Harnesses
NRF_PROG: NRF_SWDIO, NRF_SWDCK, NRF_RESET, NRF_SWO
CONNECTORS: OLED_FR, OLED_CSB, OLED_RSTB, OLED_DC, OLED_SCLK, OLED_SDIN, JTMS, JTCK, JTDO, JTDI, NJTRST, NRST, DEBUGRTS, DEBUGCTS, DEBUGTX, DEBUGRX, TRACECK, TRACED0, TRACED1, TRACED2, TRACED3
NRF_TRACE: NRF_TRACECK, NRF_TRACED0, NRF_TRACED1, NRF_TRACED2, NRF_TRACED3
NRF_UART: NRF_TX, NRF_RX, NRF_RTS, NRF_CTS

### Nets
2V2: J3.12(VDD) ; port 2V2  [project net 2V2OUT]
3V3: C21.2 C28.2 C33.2 C87.2 C91.2 J3.11(VCI) P3.1(VTref) P4.1 P6.1(VTref) P7.1 R1.1 R5.1 ; port 3V3
12V: C25.2 J3.1(VCC) J3.14(VCC) ; port 12V  [project net 12VOUT]
GND: C21.1 C25.1 C28.1 C32.1 C33.1 C34.1 C87.1 C91.1 C92.1 J3.2(AGND) J3.9(GND) J3.10(AGND) P3.3(GND) P4.3 P4.5 P4.15 P4.17 P4.19 P5.5 P6.3(GND) P7.3 P7.5 P7.9 P7.15 P7.17 P7.19 P8.5 ; port GND
DEBUGCTS: P8.4 ; port CONNECTORS.DEBUGCTS
DEBUGRTS: P8.2 ; port CONNECTORS.DEBUGRTS
DEBUGRX: P8.3 ; port CONNECTORS.DEBUGRX
DEBUGTX: P8.6 ; port CONNECTORS.DEBUGTX
JTCK: P3.4(SWCLK) P4.4 ; port CONNECTORS.JTCK  [project net JTAG_TGT_TCK]
JTDI: P3.8(TDI) P4.8 ; port CONNECTORS.JTDI  [project net JTAG_TGT_TDO]
JTDO: P3.6(SWO) P4.6 ; port CONNECTORS.JTDO  [project net JTAG_TGT_TDI]
JTMS: P3.2(SWDIO) P4.2 ; port CONNECTORS.JTMS  [project net JTAG_TGT_TMS]
NJTRST: P3.9(TRST) P4.10 ; port CONNECTORS.NJTRST
NRF_CTS: P5.4 ; port NRF_UART.NRF_CTS
NRF_RESET: P6.10(nRESET) P7.10 ; port NRF_PROG.NRF_RESET
NRF_RTS: P5.2 ; port NRF_UART.NRF_RTS
NRF_RX: P5.3 ; port NRF_UART.NRF_RX
NRF_SWDCK: P6.4(SWCLK) P7.4 ; port NRF_PROG.NRF_SWDCK
NRF_SWDIO: P6.2(SWDIO) P7.2 ; port NRF_PROG.NRF_SWDIO
NRF_SWO: P6.6(SWO) P7.6 ; port NRF_PROG.NRF_SWO
NRF_TRACECK: P7.12 ; port NRF_TRACE.NRF_TRACECK
NRF_TRACED0: P7.14 ; port NRF_TRACE.NRF_TRACED0
NRF_TRACED1: P7.16 ; port NRF_TRACE.NRF_TRACED1
NRF_TRACED2: P7.18 ; port NRF_TRACE.NRF_TRACED2
NRF_TRACED3: P7.20 ; port NRF_TRACE.NRF_TRACED3
NRF_TX: P5.6 ; port NRF_UART.NRF_TX
NRST: P3.10(nRESET) ; port CONNECTORS.NRST  [project net ETH_NRST]
OLED_CSB: J3.4(CSB) ; port CONNECTORS.OLED_CSB
OLED_DC: J3.6(DC) ; port CONNECTORS.OLED_DC
OLED_FR: J3.3(FR) ; port CONNECTORS.OLED_FR
OLED_RSTB: J3.5(RSTB) ; port CONNECTORS.OLED_RSTB
OLED_SCLK: J3.7(SCLK) ; port CONNECTORS.OLED_SCLK
OLED_SDIN: J3.8(SDIN) ; port CONNECTORS.OLED_SDIN
TRACECK: P4.12 ; port CONNECTORS.TRACECK
TRACED0: P4.14 ; port CONNECTORS.TRACED0
TRACED1: P4.16 ; port CONNECTORS.TRACED1
TRACED2: P4.18 ; port CONNECTORS.TRACED2
TRACED3: P4.20 ; port CONNECTORS.TRACED3
NetC32_2: C32.2 J3.13(VCOM)
NetC34_2: C34.2 P8.1 R5.2
NetC92_2: C92.2 P5.1 R1.2

Not connected (* = marked no-connect by the designer): P3 5(5V)* 7(RTCK)*; P4 7* 9* 11* 13*; P6 5(5V)* 7(RTCK)* 8(TDI)* 9(TRST)*; P7 7* 8* 11* 13*

### Notes on the sheet
- CONNECTORS
- (near C28) VTref
- (near P4) STM32-MCU  JTrace interface
- (near P6) NRF  Segger prog. interface
- (near P3) MCU  Segger prog. interface
- (near J3) Futaba ELW2106AA
- (near J3) OLED - Display
- VTref is needed by the programming Tool. It indicates the programming voltage.
- (near C91) VTref
- (near P7) NRF-MCU  Trace interface
- (near P5) NRF Chip  UART Debug
- (near P8) MCU  UART Debug
- (near R1) Not Fitted
- (near R5) Not Fitted
- Locate at Board Edge
- Right Angled Header
- SIGNALS
- Title
- Size:
- Date:
- A3
- Number:
- Time:
- Revision:
- Sheet
- of
- File:

### Library data of the parts
C21 C28 C34 C87 C91 C92 = Cap_0.1uF_0402_10V: 0.1µF ±20% 10V Ceramic Capacitor X5R 0402 (1005 Metric); Manufacturer: Wurth Electronics; Manufacturer PartNr: 885012105010; voltage: 10VDC; Replaceable: yes; value: 0.1uF; tolerance: 20%; Footprint/Package: 0402; Dielectric Grade: X5R; ComponentLink1Description: mouser; ComponentLink1URL: https://www.mouser.ch/ProductDetail/Wurth-Electronics/885012105010?qs=sGAEpiMZZMs0AnBnWHyRQEGbLOF2VP1ihL84oCjXnlO407YOHi%2fQbw%3d%3d; Supplier 3: Mouser; Supplier 2: Farnell; Supplier 1: Digi-Key; Supplier Part Number 1: 732-7487-1-ND; Supplier Part Number 2: 2533928; Supplier Part Number 3: 710-885012105010
C25 C32 = Cap_4.7uF_0603_16V: 4.7µF ±10% 16V Ceramic Capacitor X5R 0603 (1608 Metric); Manufracturer: Murata Electronics; Manufacturer PartNr: GRM188R61C475KAAJD; voltage: 16 VDC; Replaceable: yes; value: 4.7uF; tolerance: 10%; Dielectric Grade: X5R; Footprint/Package: 0603 (1608 metric); Supplier 1: Digi-Key; Supplier Part Number 1: 490-10481-1-ND
C33 = Cap_0.1uF_0402_16V: 0.1µF ±20% 16V Ceramic Capacitor X7R 0402 (1005 Metric); Manufacturer: KEMET; Manufacturer PartNr: C0402C104M4RACAUTO; voltage: 16VDC; Replaceable: yes; value: 0.1uF; tolerance: 20%; Footprint/Package: 0402 (1005 Metric); Dielectric Grade: X7R; ComponentLink1Description: mouser; ComponentLink1URL: https://www.mouser.ch/ProductDetail/KEMET/C0402C104M4RACAUTO?qs=sGAEpiMZZMs0AnBnWHyRQB295tntAovf0Dzw3tVX6zRfKTwHFThmZw%3d%3d; Supplier 1: Digi-Key; Supplier Part Number 1: 399-13707-1-ND
J3 = CONN_Molex_FPC_14pin_0.5mm: 14 Position FFC, FPC Connector Contacts, Top and Bottom, Pitch  0.020" (0.50mm) Surface Mount, Right Angle; Manufacturer: Molex; voltage: 50V; Replaceable: no; Manufacturer PartNr: 5034801400; Footprint/Package: specific, see datasheet; Supplier 1: Digi-Key; Supplier Part Number 1: WM1442CT-ND; value: 5034801400; tolerance: -; Dielectric Grade: -
P3 P6 = CONN_Segger_10_PIN: Segger, J-Link 10-pin Needle Adapter
P4 P7 = CONN_2X10_Header_1.27: Connector Header Surface Mount 20 position 0.050" (1.27mm); Manufacturer: CNC Tech; Replaceable: no; Footprint/Package: 2x10 Pads, see datasheet; Supplier 1: Digi-Key; ComponentLink1Description: mouser; ComponentLink1URL: https://www.mouser.ch/ProductDetail/Harwin/M50-3030342?qs=%2fha2pyFaduiRpn7Sn9fWVp%252bNpdzGcgnS82sSCZLLu%2fUjQZVEB%252bIkNw%3d%3d; Supplier Part Number 1: 1175-2646-1-ND; power: -; Dielectric Grade: -; Manufacturer PartNr: 3220-20-0300-00-TR; value: 3220-20-0300-00-TR; voltage: -
P5 P8 = CONN_2X03_FTS-103-02-F-DV: 6Pin, 2Rows, MICRO LOW-PROFILE TERMINAL STRIPS; Manufacturer: Samtec; Replaceable: *; Footprint/Package: *; Supplier 1: Digi-Key; Supplier 2: Mouser; Supplier 3: Farnell; Supplier Part Number 1: SAM13893DKR-ND; Supplier Part Number 2: 200-FTS10302FDVTR; Supplier Part Number 3: 1928022
R1 R5 = Res_DNP_0603: Resistor: do not populate; Replaceable: no; value: DNP; tolerance: *; power: *; Manufacturer: do not populate; Footprint/Package: 0603; Manufacturer PartNr: do not populate